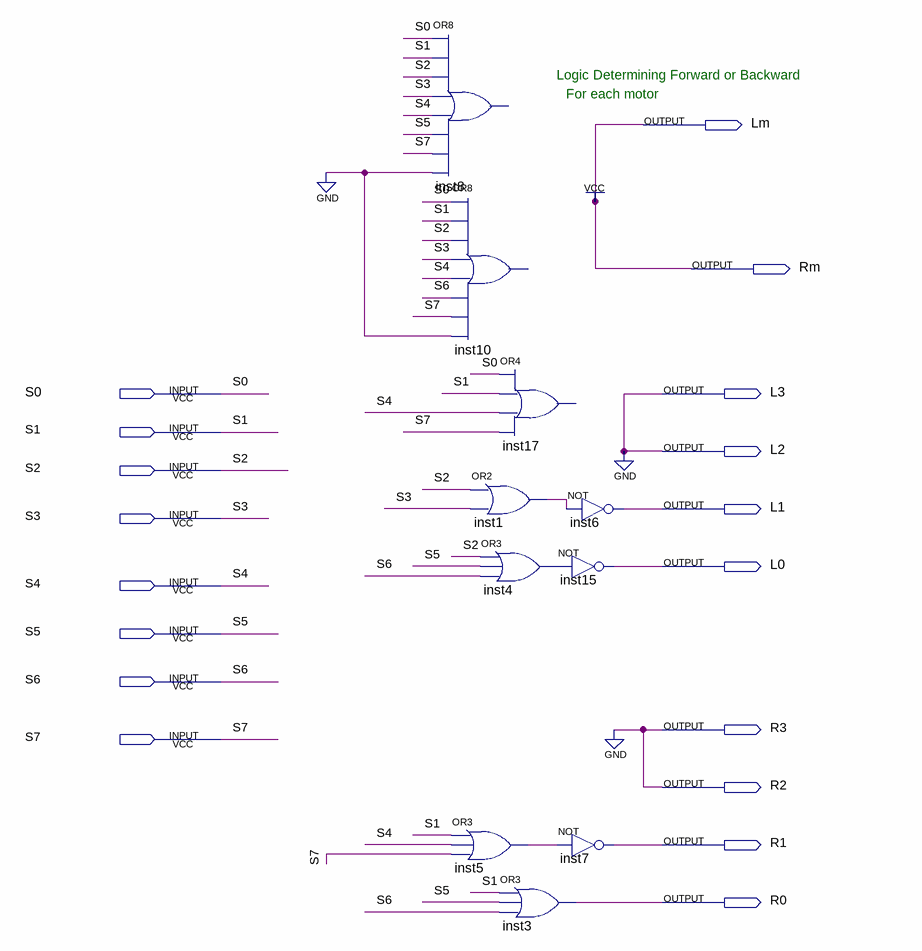
[diagram p0: schematic sheet]
// Quartus schematic output_logic.bdf as structural Verilog: 10 symbols, 18 pins
module output_logic (
  input  S0,
  input  S1,
  input  S2,
  input  S3,
  input  S4,
  input  S5,
  input  S6,
  input  S7,
  output Lm,
  output Rm,
  output L3,
  output L2,
  output L1,
  output L0,
  output R3,
  output R2,
  output R1,
  output R0
);

  wire inst1_out, inst4_out, inst5_out;

  // OR8 inst8 has open pins: IN1=S0, IN2=S1, IN3=S2, IN4=S3, IN5=S4, IN6=S5, IN7=S7, IN8=1'b0, OUT=open
  // OR8 inst10 has open pins: IN1=S0, IN2=S1, IN3=S2, IN4=S3, IN5=S4, IN6=S6, IN7=S7, IN8=1'b0, OUT=open
  or inst5 (inst5_out, S1, S4, S7);
  // OR4 inst17 has open pins: IN1=S0, IN2=S1, IN3=S4, IN4=S7, OUT=open
  or inst1 (inst1_out, S2, S3);
  or inst4 (inst4_out, S2, S5, S6);
  or inst3 (R0, S1, S5, S6);
  not inst6 (L1, inst1_out);
  not inst15 (L0, inst4_out);
  not inst7 (R1, inst5_out);

  assign L2 = 1'b0;
  assign L3 = 1'b0;
  assign Lm = 1'b1;
  assign R2 = 1'b0;
  assign R3 = 1'b0;
  assign Rm = 1'b1;

  // Notes on the sheet:
  //   Logic Determining Forward or Backward
  //   For each motor
endmodule
